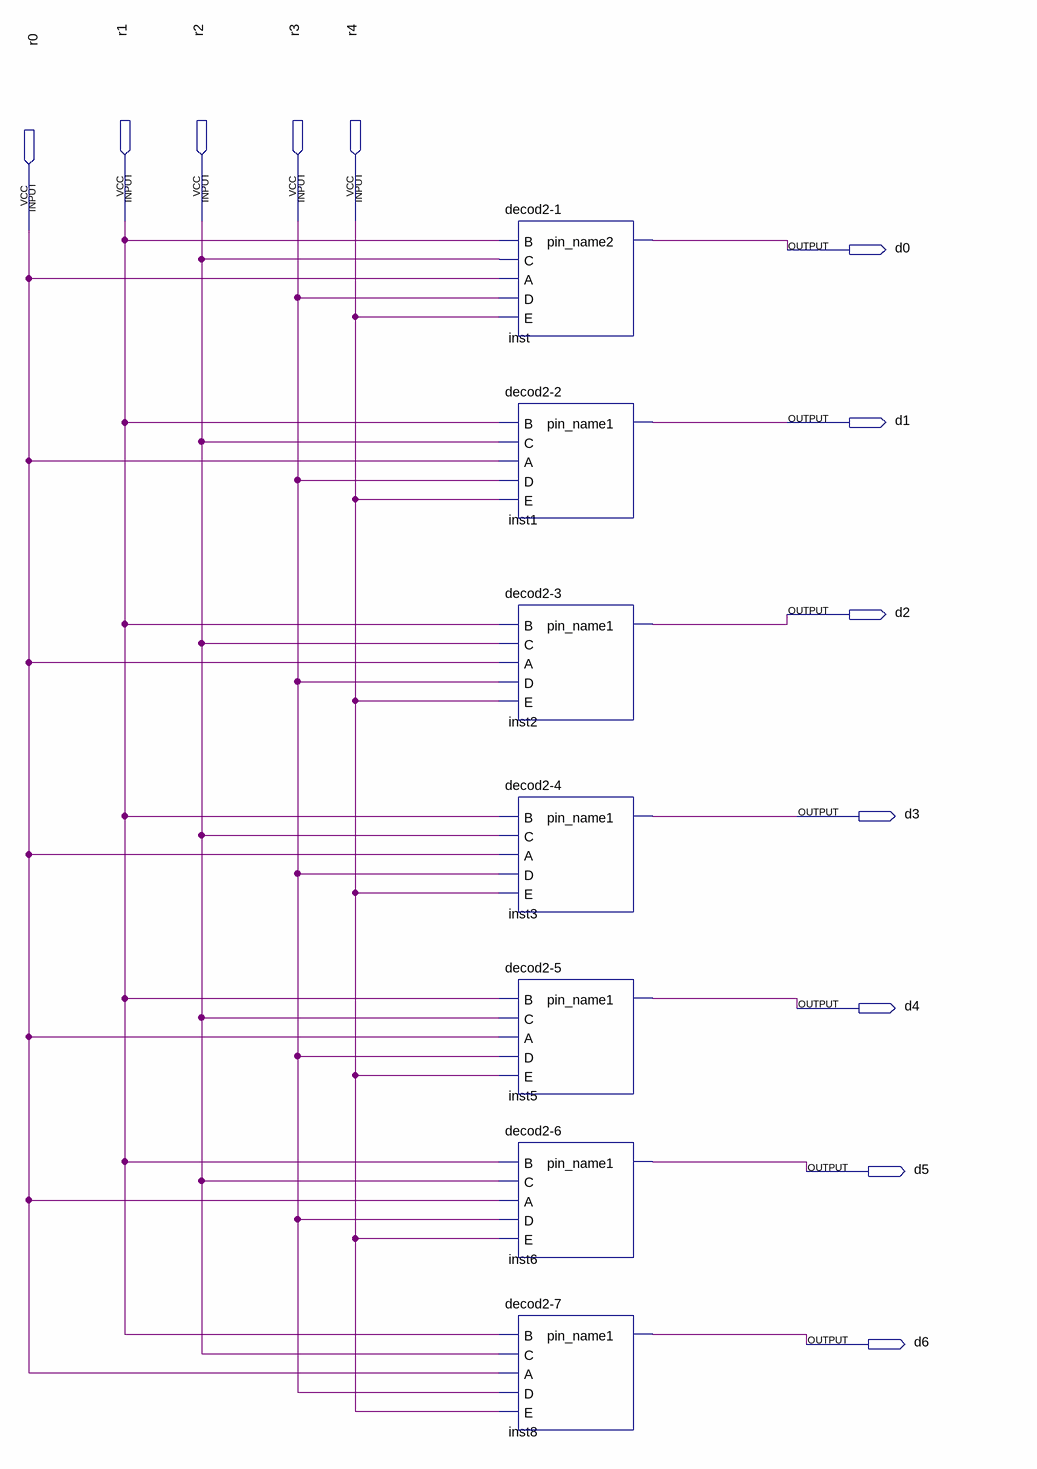
[diagram p0: schematic sheet]
// Quartus schematic decodCompleto.bdf as structural Verilog: 7 symbols, 12 pins
module decodCompleto (
  input  r1,
  input  r2,
  input  r3,
  input  r4,
  input  r0,
  output d0,
  output d1,
  output d2,
  output d3,
  output d4,
  output d5,
  output d6
);

  \decod2-1  inst (.B(r1), .C(r2), .A(r0), .D(r3), .E(r4), .pin_name2(d0));
  \decod2-2  inst1 (.B(r1), .C(r2), .A(r0), .D(r3), .E(r4), .pin_name1(d1));
  \decod2-3  inst2 (.B(r1), .C(r2), .A(r0), .D(r3), .E(r4), .pin_name1(d2));
  \decod2-4  inst3 (.B(r1), .C(r2), .A(r0), .D(r3), .E(r4), .pin_name1(d3));
  \decod2-5  inst5 (.B(r1), .C(r2), .A(r0), .D(r3), .E(r4), .pin_name1(d4));
  \decod2-6  inst6 (.B(r1), .C(r2), .A(r0), .D(r3), .E(r4), .pin_name1(d5));
  \decod2-7  inst8 (.B(r1), .C(r2), .A(r0), .D(r3), .E(r4), .pin_name1(d6));
endmodule
